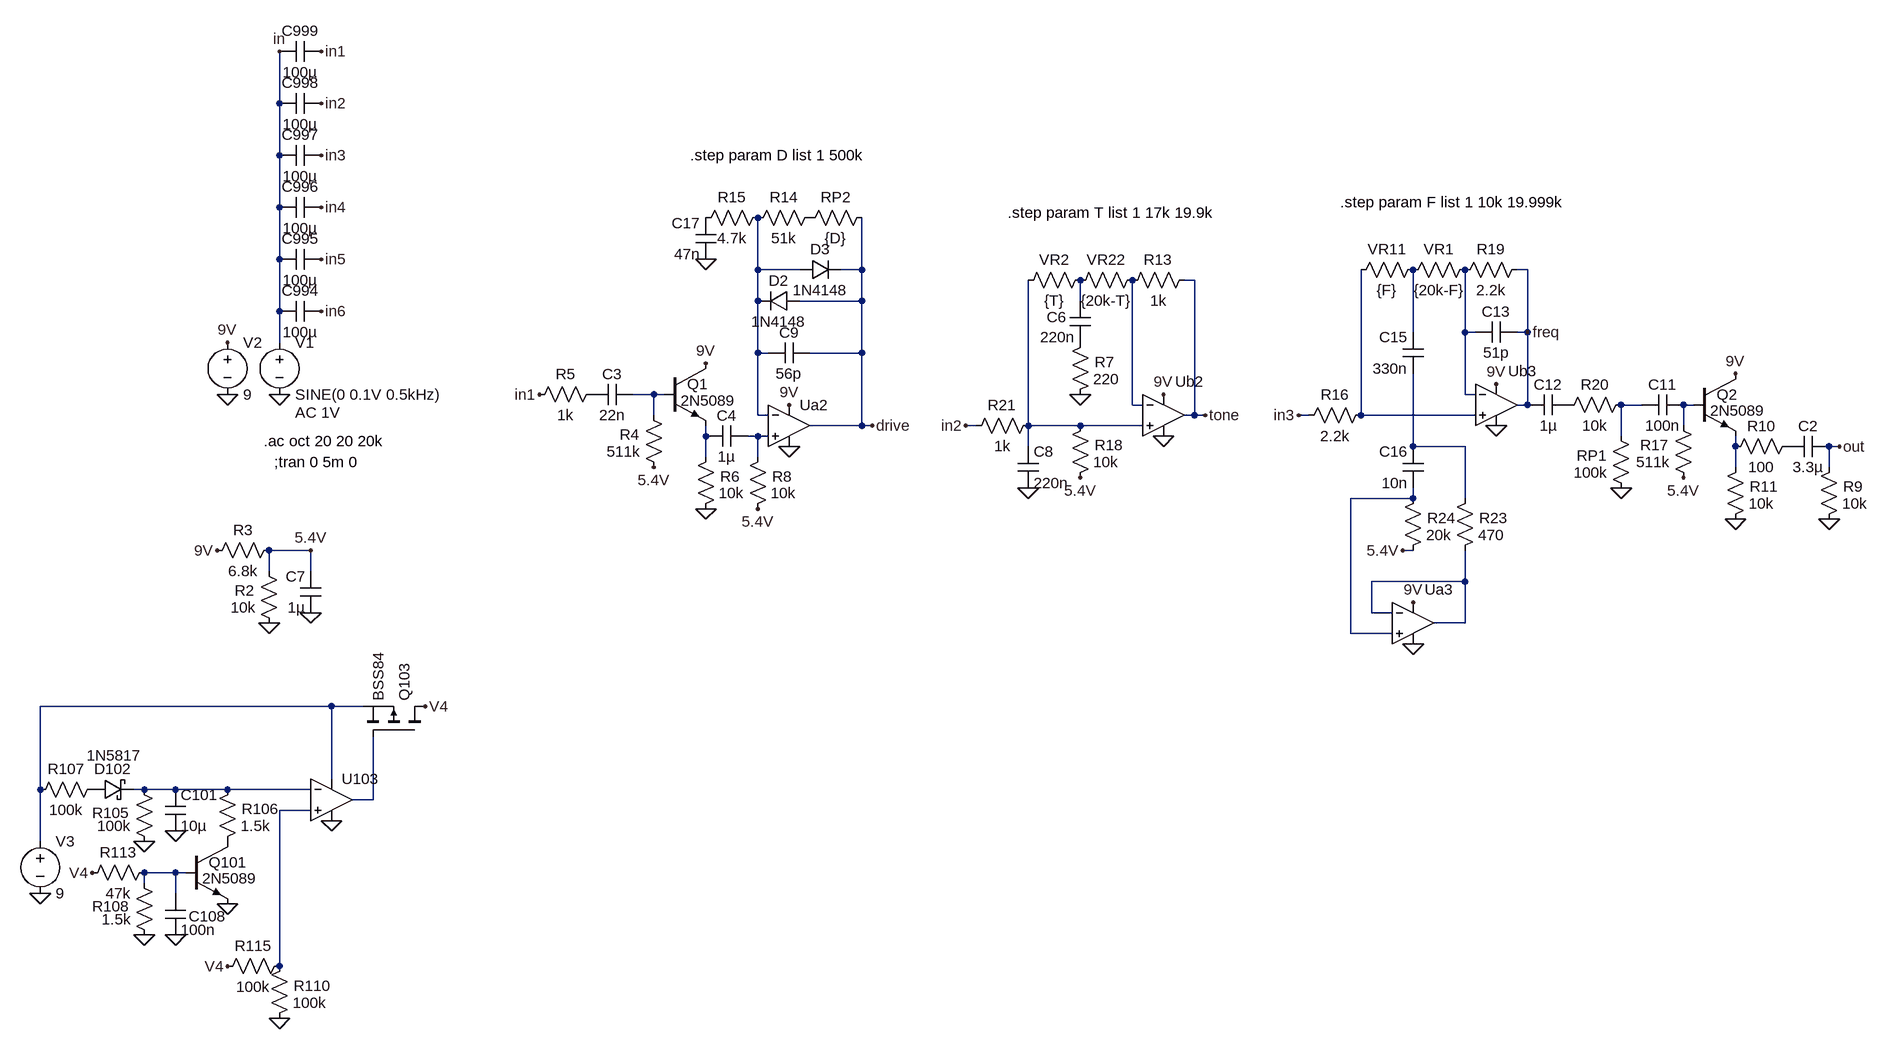
[diagram p0: schematic OverratedSpecial.asc]
OverratedSpecial.asc, the LTspice schematic file:
Version 4
SHEET 1 3200 3460
WIRE -1568 704 -1568 624
WIRE -1568 784 -1568 704
WIRE -1568 864 -1568 784
WIRE -1568 944 -1568 864
WIRE -832 960 -832 880
WIRE -768 960 -832 960
WIRE -672 960 -672 880
WIRE -672 960 -704 960
WIRE 352 960 336 960
WIRE -160 976 -176 976
WIRE -832 1008 -832 960
WIRE -672 1008 -672 960
WIRE -672 1008 -768 1008
WIRE -336 1008 -336 976
WIRE -1568 1024 -1568 944
WIRE 176 1056 176 960
WIRE 256 1056 256 960
WIRE 272 1056 256 1056
WIRE 352 1056 352 960
WIRE 352 1056 336 1056
WIRE -1568 1072 -1568 1024
WIRE -832 1088 -832 1008
WIRE -816 1088 -832 1088
WIRE -672 1088 -672 1008
WIRE -672 1088 -752 1088
WIRE -992 1152 -1024 1152
WIRE -976 1152 -992 1152
WIRE 256 1152 256 1056
WIRE 272 1152 256 1152
WIRE -256 1168 -256 976
WIRE -240 1168 -256 1168
WIRE 352 1168 352 1056
WIRE 352 1168 336 1168
WIRE 528 1168 496 1168
WIRE 608 1168 592 1168
WIRE -992 1184 -992 1152
WIRE -832 1184 -832 1088
WIRE -816 1184 -832 1184
WIRE -160 1184 -160 976
WIRE -160 1184 -176 1184
WIRE -144 1184 -160 1184
WIRE 16 1184 0 1184
WIRE 96 1184 96 960
WIRE 272 1184 96 1184
WIRE -672 1200 -672 1088
WIRE -672 1200 -752 1200
WIRE -656 1200 -672 1200
WIRE -496 1200 -512 1200
WIRE -416 1200 -416 976
WIRE -336 1200 -416 1200
WIRE -240 1200 -336 1200
WIRE 592 1200 592 1168
WIRE -912 1216 -912 1200
WIRE -832 1216 -848 1216
WIRE -816 1216 -832 1216
WIRE 496 1216 496 1168
WIRE -416 1232 -416 1200
WIRE 176 1232 176 1120
WIRE 256 1232 176 1232
WIRE 672 1232 672 1216
WIRE 832 1232 816 1232
WIRE -912 1248 -912 1216
WIRE -832 1248 -832 1216
WIRE 672 1264 672 1232
WIRE 816 1264 816 1232
WIRE 176 1312 176 1296
WIRE 176 1312 80 1312
WIRE 256 1312 256 1232
WIRE -1520 1392 -1584 1392
WIRE 176 1392 160 1392
WIRE -1584 1424 -1584 1392
WIRE -1520 1424 -1520 1392
WIRE 256 1440 256 1392
WIRE 256 1440 112 1440
WIRE 112 1488 112 1440
WIRE 144 1488 112 1488
WIRE 256 1504 256 1440
WIRE 256 1504 208 1504
WIRE 80 1520 80 1312
WIRE 144 1520 80 1520
WIRE -1488 1632 -1936 1632
WIRE -1440 1632 -1488 1632
WIRE -1488 1744 -1488 1632
WIRE -1936 1760 -1936 1632
WIRE -1776 1760 -1792 1760
WIRE -1728 1760 -1776 1760
WIRE -1648 1760 -1728 1760
WIRE -1520 1760 -1648 1760
WIRE -1424 1776 -1424 1680
WIRE -1424 1776 -1456 1776
WIRE -1520 1792 -1568 1792
WIRE -1936 1840 -1936 1760
WIRE -1728 1888 -1776 1888
WIRE -1712 1888 -1728 1888
WIRE -1776 1904 -1776 1888
WIRE -1728 1920 -1728 1888
WIRE -1568 2032 -1568 1792
FLAG -1568 1152 0
FLAG -1568 624 in
FLAG -1648 1152 0
FLAG -1648 1072 9V
FLAG -1504 624 in1
FLAG -1504 704 in2
FLAG -1504 784 in3
FLAG -1504 864 in4
FLAG -1504 944 in5
FLAG -1504 1024 in6
FLAG -1168 1152 in1
FLAG -912 1328 0
FLAG -912 1104 9V
FLAG -784 1168 9V
FLAG -784 1232 0
FLAG -1584 1504 0
FLAG -1520 1488 0
FLAG -1520 1392 5.4V
FLAG -912 944 0
FLAG -208 1152 9V
FLAG -208 1216 0
FLAG -336 1152 0
FLAG -512 1200 in2
FLAG -144 1184 tone
FLAG -1488 1808 0
FLAG -1728 1984 0
FLAG -1776 1984 0
FLAG -1856 1888 V4
FLAG -1648 1936 0
FLAG -1568 2112 0
FLAG -1648 2032 V4
FLAG -1728 1824 0
FLAG -1776 1840 0
FLAG -1344 1632 V4
FLAG -416 1296 0
FLAG 304 1136 9V
FLAG 304 1200 0
FLAG 0 1184 in3
FLAG -1664 1392 9V
FLAG -832 1328 5.4V
FLAG -336 1280 5.4V
FLAG -1936 1920 0
FLAG -992 1264 5.4V
FLAG 176 1472 9V
FLAG 176 1536 0
FLAG 160 1392 5.4V
FLAG 672 1120 9V
FLAG 592 1280 5.4V
FLAG 672 1344 0
FLAG 816 1344 0
FLAG 496 1296 0
FLAG -656 1200 drive
FLAG 352 1056 freq
FLAG 832 1232 out
SYMBOL voltage -1568 1056 R0
WINDOW 123 24 124 Left 2
WINDOW 39 0 0 Left 2
SYMATTR Value2 AC 1V
SYMATTR InstName V1
SYMATTR Value SINE(0 0.1V 0.5kHz)
SYMBOL voltage -1648 1056 R0
WINDOW 123 0 0 Left 0
WINDOW 39 0 0 Left 0
SYMATTR InstName V2
SYMATTR Value 9
SYMBOL cap -1504 688 R90
WINDOW 0 0 32 VBottom 2
WINDOW 3 32 32 VTop 2
SYMATTR InstName C998
SYMATTR Value 100µ
SYMBOL cap -1504 768 R90
WINDOW 0 0 32 VBottom 2
WINDOW 3 32 32 VTop 2
SYMATTR InstName C997
SYMATTR Value 100µ
SYMBOL cap -1504 848 R90
WINDOW 0 0 32 VBottom 2
WINDOW 3 32 32 VTop 2
SYMATTR InstName C996
SYMATTR Value 100µ
SYMBOL cap -1504 608 R90
WINDOW 0 0 32 VBottom 2
WINDOW 3 32 32 VTop 2
SYMATTR InstName C999
SYMATTR Value 100µ
SYMBOL cap -1504 928 R90
WINDOW 0 0 32 VBottom 2
WINDOW 3 32 32 VTop 2
SYMATTR InstName C995
SYMATTR Value 100µ
SYMBOL cap -1504 1008 R90
WINDOW 0 0 32 VBottom 2
WINDOW 3 32 32 VTop 2
SYMATTR InstName C994
SYMATTR Value 100µ
SYMBOL cap -1024 1136 R90
WINDOW 0 0 32 VBottom 2
WINDOW 3 32 32 VTop 2
SYMATTR InstName C3
SYMATTR Value 22n
SYMBOL npn -976 1104 R0
WINDOW 0 35 32 Left 2
WINDOW 3 25 57 Left 2
SYMATTR InstName Q1
SYMATTR Value 2N5089
SYMBOL res -1072 1136 R90
WINDOW 0 0 56 VBottom 2
WINDOW 3 32 56 VTop 2
SYMATTR InstName R5
SYMATTR Value 1k
SYMBOL res -928 1344 M180
WINDOW 0 38 66 Left 2
WINDOW 3 36 40 Left 2
SYMATTR InstName R6
SYMATTR Value 10k
SYMBOL cap -848 1200 R90
WINDOW 0 0 32 VBottom 2
WINDOW 3 32 32 VTop 2
SYMATTR InstName C4
SYMATTR Value 1µ
SYMBOL Opamps\\UniversalOpamp2 -784 1200 R0
SYMATTR InstName Ua2
SYMBOL cap -752 1072 R90
WINDOW 0 0 32 VBottom 2
WINDOW 3 32 32 VTop 2
SYMATTR InstName C9
SYMATTR Value 56p
SYMBOL res -736 864 R90
WINDOW 0 0 56 VBottom 2
WINDOW 3 32 56 VTop 2
SYMATTR InstName R14
SYMATTR Value 51k
SYMBOL diode -768 976 R270
WINDOW 0 32 32 VTop 2
WINDOW 3 0 32 VBottom 2
SYMATTR InstName D3
SYMATTR Value 1N4148
SYMBOL diode -768 1024 M270
WINDOW 0 32 32 VTop 2
WINDOW 3 0 32 VBottom 2
SYMATTR InstName D2
SYMATTR Value 1N4148
SYMBOL res -1568 1376 R90
WINDOW 0 0 56 VBottom 2
WINDOW 3 32 56 VTop 2
SYMATTR InstName R3
SYMATTR Value 6.8k
SYMBOL res -1568 1520 R180
WINDOW 0 38 66 Left 2
WINDOW 3 36 40 Left 2
SYMATTR InstName R2
SYMATTR Value 10k
SYMBOL cap -1504 1488 R180
WINDOW 0 24 56 Left 2
WINDOW 3 24 8 Left 2
SYMATTR InstName C7
SYMATTR Value 1µ
SYMBOL res -976 1280 R180
WINDOW 0 38 66 Left 2
WINDOW 3 36 40 Left 2
SYMATTR InstName R4
SYMATTR Value 511k
SYMBOL res -848 1344 M180
WINDOW 0 38 66 Left 2
WINDOW 3 36 40 Left 2
SYMATTR InstName R8
SYMATTR Value 10k
SYMBOL res -816 864 R90
WINDOW 0 0 56 VBottom 2
WINDOW 3 32 56 VTop 2
SYMATTR InstName R15
SYMATTR Value 4.7k
SYMBOL cap -896 944 R180
WINDOW 0 24 56 Left 2
WINDOW 3 24 8 Left 2
SYMATTR InstName C17
SYMATTR Value 47n
SYMBOL Opamps\\UniversalOpamp2 -208 1184 R0
WINDOW 0 18 -52 Left 2
SYMATTR InstName Ub2
SYMBOL res -160 960 R90
WINDOW 0 0 56 VBottom 2
WINDOW 3 32 56 VTop 2
SYMATTR InstName R13
SYMATTR Value 1k
SYMBOL cap -320 1072 R180
WINDOW 0 37 39 Left 2
WINDOW 3 24 8 Left 2
SYMATTR InstName C6
SYMATTR Value 220n
SYMBOL cap -432 1296 M180
WINDOW 0 24 56 Left 2
WINDOW 3 24 8 Left 2
SYMATTR InstName C8
SYMATTR Value 220n
SYMBOL res -400 1184 R90
WINDOW 0 0 56 VBottom 2
WINDOW 3 32 56 VTop 2
SYMATTR InstName R21
SYMATTR Value 1k
SYMBOL res -352 1168 M180
WINDOW 0 38 66 Left 2
WINDOW 3 36 40 Left 2
SYMATTR InstName R7
SYMATTR Value 220
SYMBOL Opamps\\UniversalOpamp2 -1488 1776 R0
SYMATTR InstName U103
SYMBOL npn -1712 1840 R0
WINDOW 0 35 32 Left 2
WINDOW 3 25 57 Left 2
SYMATTR InstName Q101
SYMATTR Value 2N5089
SYMBOL res -1664 1856 M180
WINDOW 0 38 66 Left 2
WINDOW 3 36 40 Left 2
SYMATTR InstName R106
SYMATTR Value 1.5k
SYMBOL cap -1744 1984 M180
WINDOW 0 36 29 Left 2
WINDOW 3 24 8 Left 2
SYMATTR InstName C108
SYMATTR Value 100n
SYMBOL res -1760 2000 R180
WINDOW 0 38 60 Left 2
WINDOW 3 36 40 Left 2
SYMATTR InstName R108
SYMATTR Value 1.5k
SYMBOL res -1760 1872 R90
WINDOW 0 0 56 VBottom 2
WINDOW 3 32 56 VTop 2
SYMATTR InstName R113
SYMATTR Value 47k
SYMBOL res -1552 2016 R90
WINDOW 0 0 56 VBottom 2
WINDOW 3 32 56 VTop 2
SYMATTR InstName R115
SYMATTR Value 100k
SYMBOL res -1584 2128 M180
WINDOW 0 38 66 Left 2
WINDOW 3 36 40 Left 2
SYMATTR InstName R110
SYMATTR Value 100k
SYMBOL cap -1744 1824 M180
WINDOW 0 24 56 Left 2
WINDOW 3 24 8 Left 2
SYMATTR InstName C101
SYMATTR Value 10µ
SYMBOL res -1760 1856 R180
WINDOW 0 38 60 Left 2
WINDOW 3 36 40 Left 2
SYMATTR InstName R105
SYMATTR Value 100k
SYMBOL schottky -1856 1776 R270
WINDOW 0 32 32 VTop 2
WINDOW 3 84 34 VBottom 2
SYMATTR InstName D102
SYMATTR Value 1N5817
SYMATTR Description Diode
SYMATTR Type diode
SYMBOL res -1840 1744 R90
WINDOW 0 0 56 VBottom 2
WINDOW 3 32 56 VTop 2
SYMATTR InstName R107
SYMATTR Value 100k
SYMBOL pmos -1344 1680 M270
SYMATTR InstName Q103
SYMATTR Value BSS84
SYMBOL res -656 864 R90
WINDOW 0 0 56 VBottom 2
WINDOW 3 32 56 VTop 2
SYMATTR InstName RP2
SYMATTR Value {D}
SYMBOL res -240 960 R90
WINDOW 0 0 56 VBottom 2
WINDOW 3 32 56 VTop 2
SYMATTR InstName VR22
SYMATTR Value {20k-T}
SYMBOL res -320 960 R90
WINDOW 0 0 56 VBottom 2
WINDOW 3 32 56 VTop 2
SYMATTR InstName VR2
SYMATTR Value {T}
SYMBOL res -352 1296 M180
WINDOW 0 38 66 Left 2
WINDOW 3 36 40 Left 2
SYMATTR InstName R18
SYMATTR Value 10k
SYMBOL Opamps\\UniversalOpamp2 304 1168 R0
WINDOW 0 18 -52 Left 2
SYMATTR InstName Ub3
SYMBOL cap 336 1040 R90
WINDOW 0 0 32 VBottom 2
WINDOW 3 32 32 VTop 2
SYMATTR InstName C13
SYMATTR Value 51p
SYMBOL res 352 944 R90
WINDOW 0 0 56 VBottom 2
WINDOW 3 32 56 VTop 2
SYMATTR InstName R19
SYMATTR Value 2.2k
SYMBOL cap 192 1120 R180
WINDOW 0 24 56 Left 2
WINDOW 3 24 8 Left 2
SYMATTR InstName C15
SYMATTR Value 330n
SYMBOL res 112 1168 R90
WINDOW 0 0 56 VBottom 2
WINDOW 3 32 56 VTop 2
SYMATTR InstName R16
SYMATTR Value 2.2k
SYMBOL res 272 944 R90
WINDOW 0 0 56 VBottom 2
WINDOW 3 32 56 VTop 2
SYMATTR InstName VR1
SYMATTR Value {20k-F}
SYMBOL res 192 944 R90
WINDOW 0 0 56 VBottom 2
WINDOW 3 32 56 VTop 2
SYMATTR InstName VR11
SYMATTR Value {F}
SYMBOL voltage -1936 1824 R0
WINDOW 123 0 0 Left 0
WINDOW 39 0 0 Left 0
SYMATTR InstName V3
SYMATTR Value 9
SYMBOL cap 192 1296 R180
WINDOW 0 24 56 Left 2
WINDOW 3 24 8 Left 2
SYMATTR InstName C16
SYMATTR Value 10n
SYMBOL res 160 1408 M180
WINDOW 0 38 66 Left 2
WINDOW 3 36 40 Left 2
SYMATTR InstName R24
SYMATTR Value 20k
SYMBOL res 240 1408 M180
WINDOW 0 38 66 Left 2
WINDOW 3 36 40 Left 2
SYMATTR InstName R23
SYMATTR Value 470
SYMBOL Opamps\\UniversalOpamp2 176 1504 R0
WINDOW 0 18 -52 Left 2
SYMATTR InstName Ua3
SYMBOL cap 416 1152 R90
WINDOW 0 0 32 VBottom 2
WINDOW 3 32 32 VTop 2
SYMATTR InstName C12
SYMATTR Value 1µ
SYMBOL res 512 1152 R90
WINDOW 0 0 56 VBottom 2
WINDOW 3 32 56 VTop 2
SYMATTR InstName R20
SYMATTR Value 10k
SYMBOL res 512 1312 R180
WINDOW 0 38 66 Left 2
WINDOW 3 36 40 Left 2
SYMATTR InstName RP1
SYMATTR Value 100k
SYMBOL cap 592 1152 R90
WINDOW 0 0 32 VBottom 2
WINDOW 3 32 32 VTop 2
SYMATTR InstName C11
SYMATTR Value 100n
SYMBOL npn 608 1120 R0
WINDOW 0 35 32 Left 2
WINDOW 3 25 57 Left 2
SYMATTR InstName Q2
SYMATTR Value 2N5089
SYMBOL res 656 1360 M180
WINDOW 0 38 66 Left 2
WINDOW 3 36 40 Left 2
SYMATTR InstName R11
SYMATTR Value 10k
SYMBOL res 608 1296 R180
WINDOW 0 38 66 Left 2
WINDOW 3 36 40 Left 2
SYMATTR InstName R17
SYMATTR Value 511k
SYMBOL res 768 1216 R90
WINDOW 0 0 56 VBottom 2
WINDOW 3 32 56 VTop 2
SYMATTR InstName R10
SYMATTR Value 100
SYMBOL cap 816 1216 R90
WINDOW 0 0 32 VBottom 2
WINDOW 3 32 32 VTop 2
SYMATTR InstName C2
SYMATTR Value 3.3µ
SYMBOL res 800 1360 M180
WINDOW 0 38 66 Left 2
WINDOW 3 36 40 Left 2
SYMATTR InstName R9
SYMATTR Value 10k
TEXT -1592 1224 Left 2 !.ac oct 20 20 20k
TEXT -1576 1256 Left 2 !;tran 0 5m 0
TEXT -936 784 Left 2 !.step param D list 1 500k
TEXT -448 872 Left 2 !.step param T list 1 17k 19.9k
TEXT 64 856 Left 2 !.step param F list 1 10k 19.999k

The netlist it stands for:
* OverratedSpecial.asc
V1 in 0 SINE(0 0.1V 0.5kHz) AC 1V
V2 9V 0 9
C998 in2 in 100µ
C997 in3 in 100µ
C996 in4 in 100µ
C999 in1 in 100µ
C995 in5 in 100µ
C994 in6 in 100µ
C3 N005 P001 22n
Q1 9V N005 N011 0 2N5089
R5 P001 in1 1k
R6 0 N011 10k
C4 N012 N011 1µ
XUa2 N012 N001 9V 0 drive level.2 Avol=1Meg GBW=10Meg Slew=10Meg ilimit=25m rail=0 Vos=0 phimargin=45 en=0 enk=0 in=0 ink=0 Rin=500Meg  ; pins IN+ IN- V+ V- OUT
C9 drive N001 56p
R14 P002 N001 51k
D3 N001 drive 1N4148
D2 drive N001 1N4148
R3 5.4V 9V 6.8k
R2 0 5.4V 10k
C7 0 5.4V 1µ
R4 5.4V N005 511k
R8 5.4V N012 10k
R15 N001 P003 4.7k
C17 0 P003 47n
XUb2 N010 N006 9V 0 tone level.2 Avol=1Meg GBW=10Meg Slew=10Meg ilimit=25m rail=0 Vos=0 phimargin=45 en=0 enk=0 in=0 ink=0 Rin=500Meg  ; pins IN+ IN- V+ V- OUT
R13 tone N006 1k
C6 P004 N002 220n
C8 0 N010 220n
R21 N010 in2 1k
R7 0 P004 220
XU103 N020 N018 N017 0 N019 level.2 Avol=1Meg GBW=10Meg Slew=10Meg ilimit=25m rail=0 Vos=0 phimargin=45 en=0 enk=0 in=0 ink=0 Rin=500Meg  ; pins IN+ IN- V+ V- OUT
Q101 P005 N021 0 0 2N5089
R106 P005 N018 1.5k
C108 0 N021 100n
R108 0 N021 1.5k
R113 N021 V4 47k
R115 N020 V4 100k
R110 0 N020 100k
C101 0 N018 10µ
R105 0 N018 100k
D102 P006 N018 1N5817
R107 P006 N017 100k
M§Q103 V4 N019 N017 N017 BSS84
RP2 drive P002 {D}
R§VR22 N006 N002 {20k-T}
R§VR2 N002 N010 {T}
R18 5.4V N010 10k
XUb3 N009 N004 9V 0 freq level.2 Avol=1Meg GBW=10Meg Slew=10Meg ilimit=25m rail=0 Vos=0 phimargin=45 en=0 enk=0 in=0 ink=0 Rin=500Meg  ; pins IN+ IN- V+ V- OUT
C13 freq N004 51p
R19 freq N004 2.2k
C15 N013 N003 330n
R16 N009 in3 2.2k
R§VR1 N004 N003 {20k-F}
R§VR11 N003 N009 {F}
V3 N017 0 9
C16 N015 N013 10n
R24 5.4V N015 20k
R23 N016 N013 470
XUa3 N015 N016 9V 0 N016 level.2 Avol=1Meg GBW=10Meg Slew=10Meg ilimit=25m rail=0 Vos=0 phimargin=45 en=0 enk=0 in=0 ink=0 Rin=500Meg  ; pins IN+ IN- V+ V- OUT
C12 P007 freq 1µ
R20 N007 P007 10k
RP1 0 N007 100k
C11 N008 N007 100n
Q2 9V N008 N014 0 2N5089
R11 0 N014 10k
R17 5.4V N008 511k
R10 P008 N014 100
C2 out P008 3.3µ
R9 0 out 10k
.model D D
.lib standard.dio
.model NPN NPN
.model PNP PNP
.lib standard.bjt
.model NMOS NMOS
.model PMOS PMOS
.lib standard.mos
.ac oct 20 20 20k
;tran 0 5m 0
.step param D list 1 500k
.step param T list 1 17k 19.9k
.step param F list 1 10k 19.999k
.lib UniversalOpamps2.sub
.backanno
.end